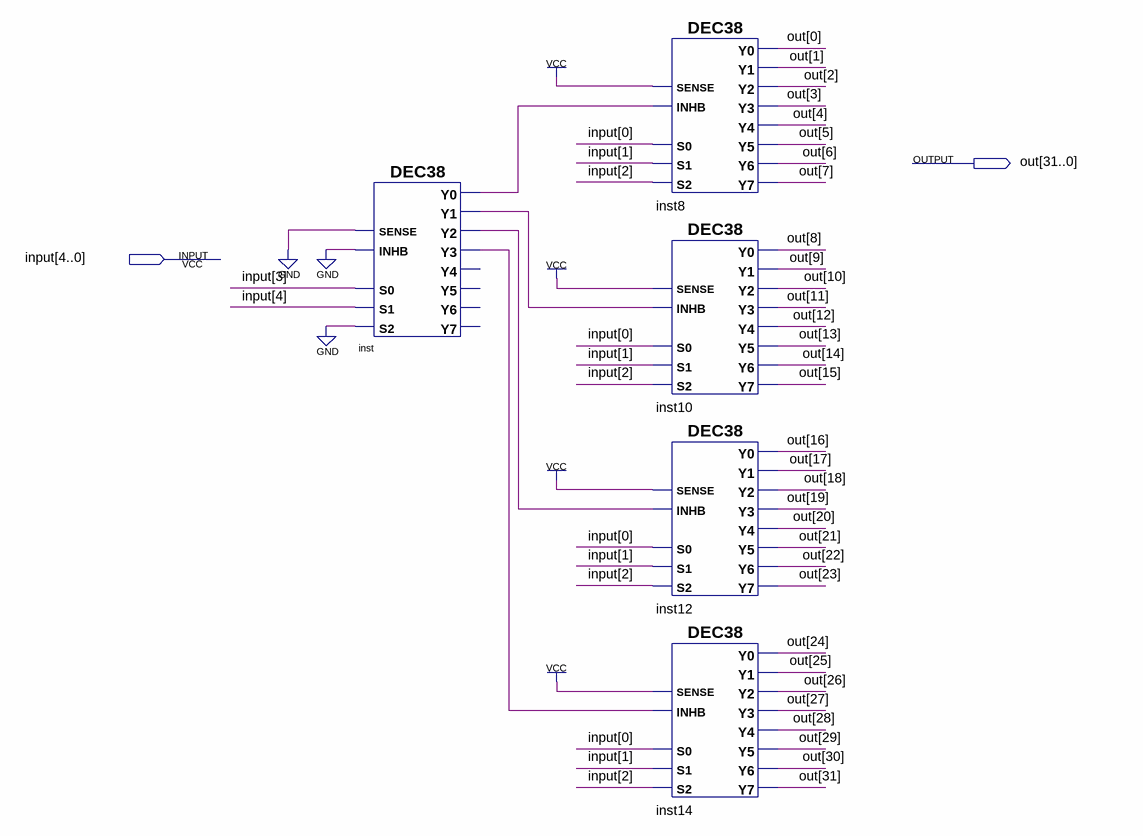
[diagram p0: schematic sheet]
// Quartus schematic decoder32.bdf as structural Verilog: 5 symbols, 2 pins
module decoder32 (
  input  [4:0] \input ,
  output [31:0] out
);

  wire inst_y0, inst_y1, inst_y2, inst_y3;

  DEC38 inst (
    .S2(1'b0), .S1(\input [4]), .INHB(1'b0), .S0(\input [3]), .SENSE(1'b0), .Y3(inst_y3), .Y0(inst_y0),
    .Y1(inst_y1), .Y2(inst_y2));  // open: Y7, Y6, Y5, Y4
  DEC38 inst8 (
    .S2(\input [2]), .S1(\input [1]), .INHB(inst_y0), .S0(\input [0]), .SENSE(1'b1), .Y7(out[7]),
    .Y6(out[6]), .Y5(out[5]), .Y3(out[3]), .Y4(out[4]), .Y0(out[0]), .Y1(out[1]), .Y2(out[2]));
  DEC38 inst10 (
    .S2(\input [2]), .S1(\input [1]), .INHB(inst_y1), .S0(\input [0]), .SENSE(1'b1), .Y7(out[15]),
    .Y6(out[14]), .Y5(out[13]), .Y3(out[11]), .Y4(out[12]), .Y0(out[8]), .Y1(out[9]), .Y2(out[10]));
  DEC38 inst12 (
    .S2(\input [2]), .S1(\input [1]), .INHB(inst_y2), .S0(\input [0]), .SENSE(1'b1), .Y7(out[23]),
    .Y6(out[22]), .Y5(out[21]), .Y3(out[19]), .Y4(out[20]), .Y0(out[16]), .Y1(out[17]), .Y2(out[18]));
  DEC38 inst14 (
    .S2(\input [2]), .S1(\input [1]), .INHB(inst_y3), .S0(\input [0]), .SENSE(1'b1), .Y7(out[31]),
    .Y6(out[30]), .Y5(out[29]), .Y3(out[27]), .Y4(out[28]), .Y0(out[24]), .Y1(out[25]), .Y2(out[26]));
endmodule
